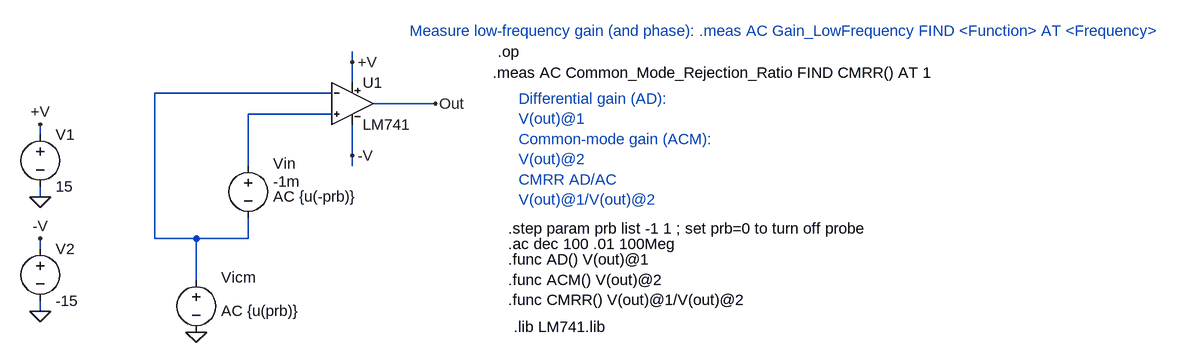
[diagram p0: schematic CMRR.asc]
CMRR.asc, the LTspice schematic file:
Version 4
SHEET 1 1464 1652
WIRE -1120 1168 -1120 1152
WIRE -1120 1200 -1120 1168
WIRE -1152 1216 -1424 1216
WIRE -992 1232 -1088 1232
WIRE -1152 1248 -1280 1248
WIRE -1600 1280 -1600 1264
WIRE -1120 1312 -1120 1264
WIRE -1280 1328 -1280 1248
WIRE -1120 1328 -1120 1312
WIRE -1600 1376 -1600 1360
WIRE -1424 1440 -1424 1216
WIRE -1360 1440 -1424 1440
WIRE -1280 1440 -1280 1408
WIRE -1280 1440 -1360 1440
WIRE -1600 1456 -1600 1440
WIRE -1360 1504 -1360 1440
WIRE -1600 1552 -1600 1536
FLAG -1360 1584 0
FLAG -992 1232 Out
FLAG -1600 1376 0
FLAG -1600 1552 0
FLAG -1600 1264 +V
FLAG -1600 1440 -V
FLAG -1120 1168 +V
FLAG -1120 1312 -V
DATAFLAG -1024 1232 ""
DATAFLAG -1296 1216 ""
DATAFLAG -1216 1248 ""
SYMBOL voltage -1280 1312 R0
WINDOW 123 38 63 Left 2
WINDOW 39 0 0 Left 2
WINDOW 0 38 12 Left 2
WINDOW 3 38 40 Left 2
SYMATTR Value2 AC {u(-prb)}
SYMATTR InstName Vin
SYMATTR Value -1m
SYMBOL voltage -1360 1488 R0
WINDOW 123 38 63 Left 2
WINDOW 39 0 0 Left 2
WINDOW 0 38 12 Left 2
WINDOW 3 -188 38 Left 2
SYMATTR Value2 AC {u(prb)}
SYMATTR InstName Vicm
SYMATTR Value ""
SYMBOL voltage -1600 1264 R0
WINDOW 123 0 0 Left 2
WINDOW 39 0 0 Left 2
SYMATTR InstName V1
SYMATTR Value 15
SYMBOL voltage -1600 1440 R0
WINDOW 123 0 0 Left 2
WINDOW 39 0 0 Left 2
SYMATTR InstName V2
SYMATTR Value -15
SYMBOL LM741 -1120 1168 R0
SYMATTR InstName U1
TEXT -880 1424 Left 2 !.step param prb list -1 1 ; set prb=0 to turn off probe
TEXT -880 1448 Left 2 !.ac dec 100 .01 100Meg
TEXT -1032 1120 Left 2 ;Measure low-frequency gain (and phase): .meas AC Gain_LowFrequency FIND <Function> AT <Frequency>
TEXT -864 1224 Left 2 ;Differential gain (AD):\nV(out)@1\nCommon-mode gain (ACM):\nV(out)@2\nCMRR AD/AC\nV(out)@1/V(out)@2
TEXT -904 1184 Left 2 !.meas AC Common_Mode_Rejection_Ratio FIND CMRR() AT 1
TEXT -880 1472 Left 2 !.func AD() V(out)@1\n.func ACM() V(out)@2\n.func CMRR() V(out)@1/V(out)@2
TEXT -872 1576 Left 2 !.lib LM741.lib
TEXT -896 1152 Left 2 !.op

The netlist it stands for:
* CMRR.asc
Vin N002 N001 -1m AC {u(-prb)}
Vicm N001 0 AC {u(prb)}
V1 +V 0 15
V2 -V 0 -15
XU1 N002 N001 +V -V Out LM741  ; pins In+ In- V+ V- OUT
.step param prb list -1 1 ; set prb=0 to turn off probe
.ac dec 100 .01 100Meg
* Measure low-frequency gain (and phase): .meas AC Gain_LowFrequency FIND <Function> AT <Frequency>
* Differential gain (AD):
* V(out)@1
* Common-mode gain (ACM):
* V(out)@2
* CMRR AD/AC
* V(out)@1/V(out)@2
.meas AC Common_Mode_Rejection_Ratio FIND CMRR() AT 1
.func AD() V(out)@1
.func ACM() V(out)@2
.func CMRR() V(out)@1/V(out)@2
.lib LM741.lib
.op
.lib LM741.lib
.backanno
.end